# Altium schematic sheet Optoisolator Pair.SchDoc
size A; SheetNumber: 5; SheetTotal: 11
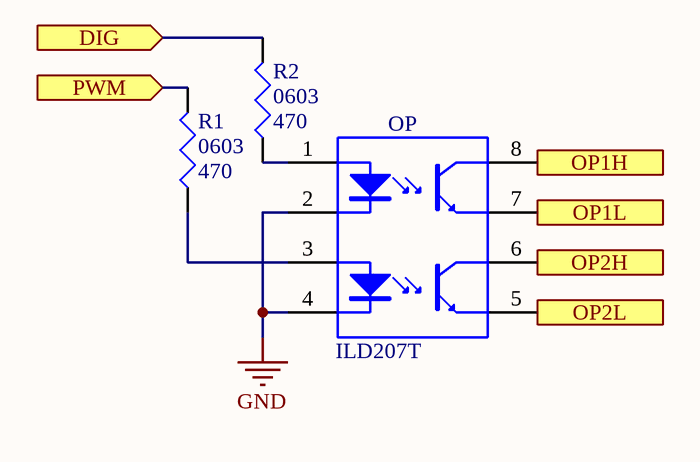
[diagram p0: Optoisolator Pair.SchDoc]

## Parts
OP  ILD207T  [VISH-SOIC-8_C_V]
R1  0603  value 470  [J1-0603]
R2  0603  value 470  [J1-0603]

## Ports
DIG (in), OP1H (in), OP1L (out), OP2H (in), OP2L (out), PWM (in)

## Nets
GND: OP.2(K) OP.4(K)
DIG: R2.2 ; port DIG
OP1H: OP.8(C) ; port OP1H
OP1L: OP.7(E) ; port OP1L
OP2H: OP.6(C) ; port OP2H
OP2L: OP.5(E) ; port OP2L
PWM: R1.2 ; port PWM
NetOP_1: OP.1(A) R2.1
NetOP_3: OP.3(A) R1.1

## Library data of the parts
OP = CMP-2000-06453-1: Optocoupler, Phototransistor Output, Dual Channel, 4000 VRMS, -55 to 100 degC, 8-Pin SOIC, RoHS, Tape and Reel; Manufacturer: Vishay; Voltage - Output (Max): 70V; Vce Saturation (Max): 400mV; Number of Channels: 2; Voltage - Forward (Vf) (Typ): 1.2V; EDA / CAD Models: DownloadfromAcceleratedDesigns; Current Transfer Ratio (Min): 100%@10mA; Current Transfer Ratio (Max): 200%@10mA; Input Type: DC; Current - DC Forward (If) (Max): 30mA; Rise / Fall Time (Typ): 3µs,4.7µs; Turn On / Turn Off Time (Typ): 6µs,5µs; Catalog Drawings: OptocouplerCircuit; Other Names: 751-1310-1ILD207TGICTILD207TGICT-ND; Online Catalog: ILD205T,206T,207T,211T,213T,217TSeries; Mounting Type: SurfaceMount; Package Description: 8-Pin Small Outline Integrated Circuit, Body 5.84 x 3.91 mm, Pitch 1.27 mm; Output Type: Transistor; Package / Case: 8-SOIC(0.154",3.90mmWidth); Category: Isolators; Operating Temperature: -55°C~100°C; Family: Optoisolators-Transistor,PhotovoltaicOutput; Package Reference: SOIC-8; Voltage - Isolation: 4000Vrms; Supplier Device Package: 8-SOIC; Standard Package: 1; Manufacturer URL: http://www.vishay.com/; Series: -; Packaging: CutTape(CT); Datasheet Version: Rev. 2.1, 10/2015; Datasheet URL: http://www.vishay.com/docs/83647/ild205t.pdf; Mounting Technology: SurfaceMount; Current - Output / Channel: -
R1 R2 = Res3: Resistor; Published: 8-Jun-2000; LatestRevisionDate: 29-May-2009; LatestRevisionNote: IPC-7351 Footprint Added.; PackageReference: J1-0603; Publisher: Altium Limited; PackageDescription: Chip Resistor